# Altium schematic sheet Thermocouple_Amplifier.SchDoc
size Letter; Organization: Altium Limited; Address1: L3, 12a Rodborough Rd; Address2: Frenchs Forest; Address3: NSW; Address4: Australia 2086
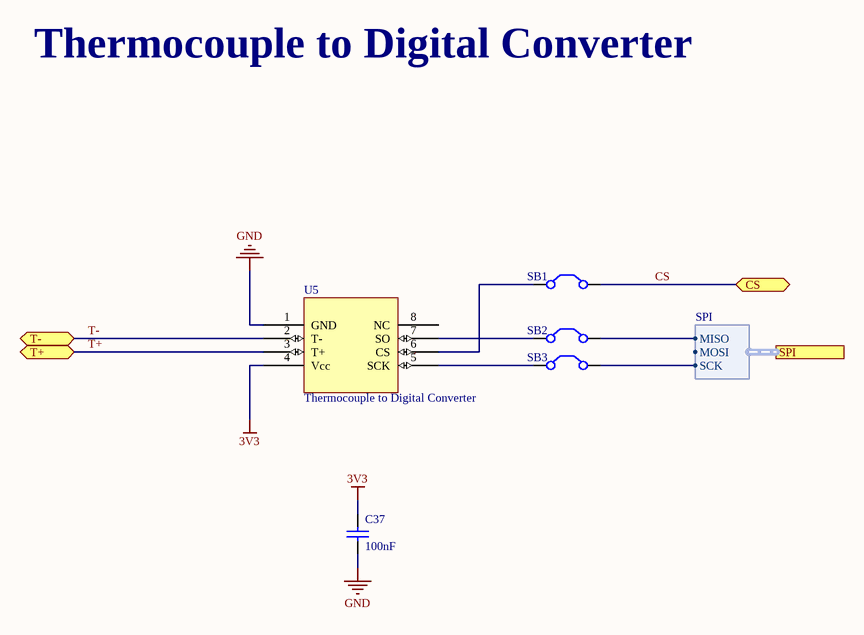
[diagram p0: Thermocouple_Amplifier.SchDoc]

## Parts
C37  value 100nF  [0603]  (hidden comment: Cap)
SB1  Solder Bridge  [Solder Bridge]  (value not drawn)
SB2  Solder Bridge  [Solder Bridge]  (value not drawn)
SB3  Solder Bridge  [Solder Bridge]  (value not drawn)
U5  Thermocouple to Digital Converter  [8-SOIC MAXIM]

## Ports
CS (bidir), SPI (harness SPI), T+ (bidir), T- (bidir)

## Harnesses
SPI: MISO, MOSI, SCK

## Nets
3V3: C37.2 U5.4(Vcc)
GND: C37.1 U5.1(GND)
CS: SB1.2(C2) ; port CS
T+: U5.3(T+) ; port T+
T-: U5.2(T-) ; port T-
NetSB1_1: SB1.1(C1) U5.6(CS)
NetSB2_1: SB2.1(C1) U5.7(SO)
NetSB2_2: SB2.2(C2) ; port SPI.MISO
NetSB3_1: SB3.1(C1) U5.5(SCK)
NetSB3_2: SB3.2(C2) ; port SPI.SCK

Not connected (* = marked no-connect by the designer): U5 8(NC)

## Notes on the sheet
- Thermocouple to Digital Converter
- Title
- Size:
- Date:
- Letter
- Number:
- Time:
- Revision:
- Sheet
- of
- File:

## Library data of the parts
C37 = Cap: Capacitor
SB1-SB3 = Jumper: Jumper Wire
U5 = MAX31855x: Manufacturer PN: MAX31855EASA+; Thermocouple Type: E; DigiKey PN: MAX31855EASA+-ND